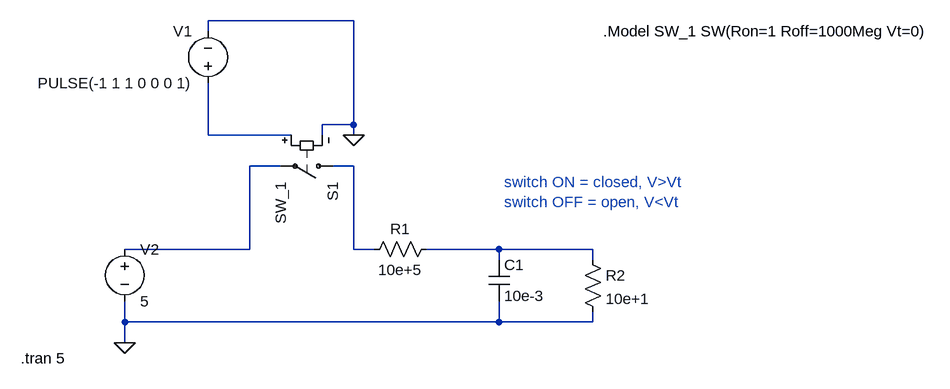
[diagram p0: schematic switch.asc]
switch.asc, the LTspice schematic file:
Version 4
SHEET 1 1112 680
WIRE 176 -32 -48 -32
WIRE -48 -16 -48 -32
WIRE 176 128 176 -32
WIRE 176 128 128 128
WIRE -48 144 -48 64
WIRE 80 144 -48 144
WIRE 128 144 128 128
WIRE 176 144 176 128
WIRE 64 192 16 192
WIRE 176 192 144 192
WIRE 16 320 16 192
WIRE 16 320 -176 320
WIRE 176 320 176 192
WIRE 208 320 176 320
WIRE 400 320 288 320
WIRE 544 320 400 320
WIRE 400 336 400 320
WIRE 544 336 544 320
WIRE -176 432 -176 400
WIRE 400 432 400 400
WIRE 400 432 -176 432
WIRE 544 432 544 416
WIRE 544 432 400 432
WIRE -176 464 -176 432
FLAG 176 144 0
FLAG -176 464 0
SYMBOL sw 160 192 R90
SYMATTR InstName S1
SYMATTR Value SW_1
SYMBOL voltage -48 80 R180
WINDOW 0 24 96 Left 2
WINDOW 3 24 16 Left 2
WINDOW 123 0 0 Left 0
WINDOW 39 0 0 Left 0
SYMATTR InstName V1
SYMATTR Value PULSE(-1 1 1 0 0 0 1)
SYMBOL voltage -176 304 R0
WINDOW 123 0 0 Left 0
WINDOW 39 0 0 Left 0
SYMATTR InstName V2
SYMATTR Value 5
SYMBOL res 304 304 R90
WINDOW 0 0 56 VBottom 2
WINDOW 3 32 56 VTop 2
SYMATTR InstName R1
SYMATTR Value 10e+5
SYMBOL cap 384 336 R0
SYMATTR InstName C1
SYMATTR Value 10e-3
SYMBOL res 528 320 R0
SYMATTR InstName R2
SYMATTR Value 10e+1
TEXT 560 -16 Left 2 !.Model SW_1 SW(Ron=1 Roff=1000Meg Vt=0)
TEXT -336 488 Left 2 !.tran 5
TEXT 408 216 Left 2 ;switch ON = closed, V>Vt\nswitch OFF = open, V<Vt

The netlist it stands for:
* switch.asc
S1 N003 N002 N001 0 SW_1
V1 N001 0 PULSE(-1 1 1 0 0 0 1)
V2 N002 0 5
R1 N004 N003 10e+5
C1 N004 0 10e-3
R2 N004 0 10e+1
.Model SW_1 SW(Ron=1 Roff=1000Meg Vt=0)
.tran 5
* switch ON = closed, V>Vt
* switch OFF = open, V<Vt
.backanno
.end